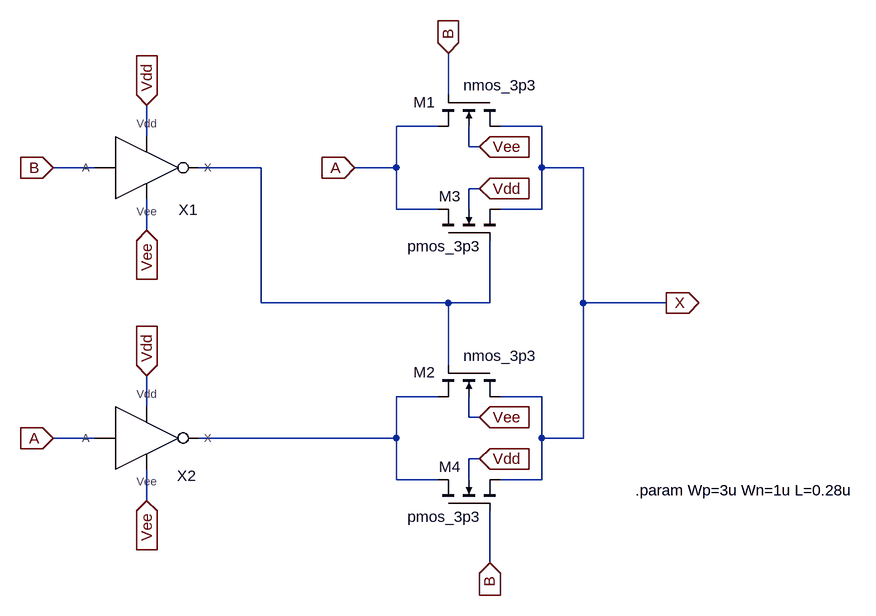
[diagram p0: schematic XNOR2x1.asc]
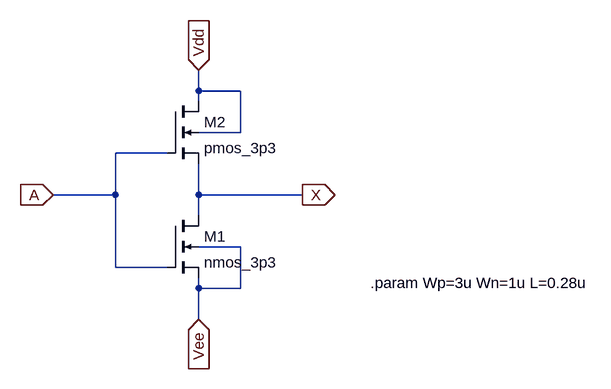
[diagram p1: sub-circuit invx1.asc]
XNOR2x1.asc, the LTspice schematic file:
Version 4
SHEET 1 1124 680
WIRE 176 -192 176 -256
WIRE 160 -144 96 -144
WIRE 320 -144 256 -144
WIRE -288 -128 -288 -176
WIRE 208 -112 208 -144
WIRE 224 -112 208 -112
WIRE -368 -80 -432 -80
WIRE -112 -80 -208 -80
WIRE 96 -80 96 -144
WIRE 96 -80 32 -80
WIRE 320 -80 320 -144
WIRE 384 -80 320 -80
WIRE 224 -48 208 -48
WIRE 96 -16 96 -80
WIRE 160 -16 96 -16
WIRE 208 -16 208 -48
WIRE 320 -16 320 -80
WIRE 320 -16 256 -16
WIRE -288 16 -288 -32
WIRE -112 128 -112 -80
WIRE 176 128 -112 128
WIRE 240 128 240 32
WIRE 240 128 176 128
WIRE 384 128 384 -80
WIRE 512 128 384 128
WIRE 176 224 176 128
WIRE 160 272 96 272
WIRE 320 272 256 272
WIRE -288 288 -288 240
WIRE 208 304 208 272
WIRE 224 304 208 304
WIRE -368 336 -432 336
WIRE 96 336 96 272
WIRE 96 336 -208 336
WIRE 320 336 320 272
WIRE 384 336 384 128
WIRE 384 336 320 336
WIRE 224 368 208 368
WIRE 96 400 96 336
WIRE 160 400 96 400
WIRE 208 400 208 368
WIRE 320 400 320 336
WIRE 320 400 256 400
WIRE -288 432 -288 384
WIRE 240 528 240 448
FLAG 32 -80 A
IOPIN 32 -80 In
FLAG 176 -256 B
IOPIN 176 -256 In
FLAG -432 336 A
IOPIN -432 336 In
FLAG -432 -80 B
IOPIN -432 -80 In
FLAG -288 -176 Vdd
IOPIN -288 -176 In
FLAG -288 240 Vdd
IOPIN -288 240 In
FLAG -288 16 Vee
IOPIN -288 16 In
FLAG -288 432 Vee
IOPIN -288 432 In
FLAG 240 528 B
IOPIN 240 528 In
FLAG 512 128 X
IOPIN 512 128 Out
FLAG 224 -48 Vdd
IOPIN 224 -48 In
FLAG 224 -112 Vee
IOPIN 224 -112 In
FLAG 224 304 Vee
IOPIN 224 304 In
FLAG 224 368 Vdd
IOPIN 224 368 In
SYMBOL nmos4 256 -192 R90
WINDOW 0 11 100 VRight 2
WINDOW 3 -15 -57 VRight 2
SYMATTR InstName M1
SYMATTR Value nmos_3p3
SYMATTR Value2 l={L} w={Wn  }
SYMBOL nmos4 160 32 R270
WINDOW 0 68 2 VRight 2
WINDOW 3 -9 -47 VRight 2
SYMATTR InstName M3
SYMATTR Value pmos_3p3
SYMATTR Value2 l={L} w={Wp}
SYMBOL INVx1 -288 -80 R0
WINDOW 0 64 49 Top 2
SYMATTR InstName X1
SYMBOL INVx1 -288 336 R0
WINDOW 0 61 42 Top 2
SYMATTR InstName X2
SYMBOL nmos4 256 224 R90
WINDOW 0 11 100 VRight 2
WINDOW 3 -15 -57 VRight 2
SYMATTR InstName M2
SYMATTR Value nmos_3p3
SYMATTR Value2 l={L} w={Wn}
SYMBOL nmos4 160 448 R270
WINDOW 0 68 2 VRight 2
WINDOW 3 -9 -47 VRight 2
SYMATTR InstName M4
SYMATTR Value pmos_3p3
SYMATTR Value2 l={L} w={Wp}
TEXT 464 416 Left 2 !.param Wp=3u Wn=1u L=0.28u

invx1.asc, the sub-circuit schematic file:
Version 4
SHEET 1 2776 836
WIRE 416 -16 416 -48
WIRE 480 -16 416 -16
WIRE 416 0 416 -16
WIRE 480 48 480 -16
WIRE 480 48 416 48
WIRE 368 80 288 80
WIRE 288 144 288 80
WIRE 288 144 192 144
WIRE 416 144 416 96
WIRE 576 144 416 144
WIRE 416 176 416 144
WIRE 480 224 416 224
WIRE 288 256 288 144
WIRE 368 256 288 256
WIRE 416 288 416 272
WIRE 480 288 480 224
WIRE 480 288 416 288
WIRE 416 336 416 288
FLAG 416 -48 Vdd
IOPIN 416 -48 In
FLAG 192 144 A
IOPIN 192 144 In
FLAG 576 144 X
IOPIN 576 144 Out
FLAG 416 336 Vee
IOPIN 416 336 In
SYMBOL nmos4 368 176 R0
SYMATTR InstName M1
SYMATTR Value nmos_3p3
SYMATTR Value2 l={L} w={Wn}
SYMBOL nmos4 368 0 R0
SYMATTR InstName M2
SYMATTR Value pmos_3p3
SYMATTR Value2 l={L} w={Wp}
TEXT 680 280 Left 2 !.param Wp=3u Wn=1u L=0.28u

The netlist it stands for:
* XNOR2x1.asc
M1 X B A Vee nmos_3p3 l={L} w={Wn  }
M3 A N001 X Vdd pmos_3p3 l={L} w={Wp}
XX1 B Vdd N001 Vee invx1
XX2 A Vdd N002 Vee invx1
M2 X N001 N002 Vee nmos_3p3 l={L} w={Wn}
M4 N002 B X Vdd pmos_3p3 l={L} w={Wp}

* block symbol definitions
.subckt invx1 A Vdd X Vee
M1 X A Vee Vee nmos_3p3 l={L} w={Wn}
M2 Vdd A X Vdd pmos_3p3 l={L} w={Wp}
.param Wp=3u Wn=1u L=0.28u
.ends invx1

.model NMOS NMOS
.model PMOS PMOS
.lib standard.mos
.param Wp=3u Wn=1u L=0.28u
.backanno
.end